# Altium project TPA3126.PrjPcb
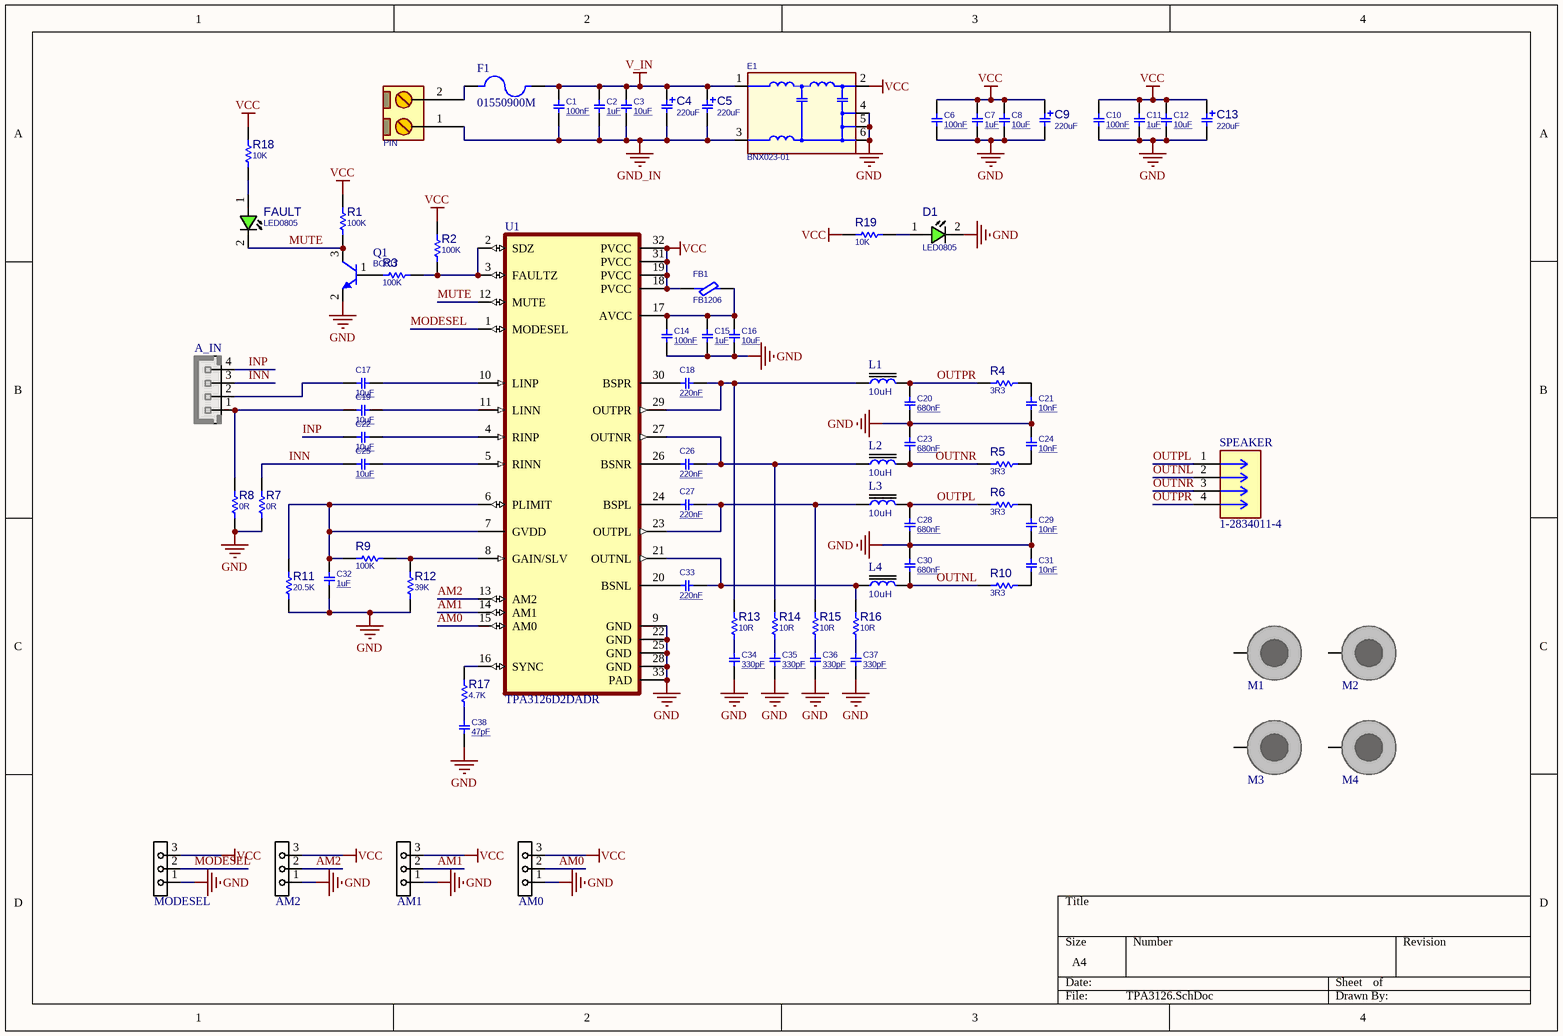
[diagram p0: TPA3126.SchDoc]
1 sheet, 79 parts. Net scope: global (net labels, ports and power ports of the same name join across sheets).
Board file: TPA3126.PcbDoc

## Sheet TPA3126.SchDoc
size A4; SheetNumber: 1; SheetTotal: 1

### Parts
A_IN  HHDR_4  [XH_4]  (value not drawn)
AM0  JMPHDR3PIN  [JP_3_60W]  (value not drawn)
AM1  JMPHDR3PIN  [JP_3_60W]  (value not drawn)
AM2  JMPHDR3PIN  [JP_3_60W]  (value not drawn)
C1  100nF  [C0805]
C2  1uF  [C0805]
C3  10uF  [C0805]
C4  220uF  [C_EL_8X12]
C5  220uF  [C_EL_8X12]
C6  100nF  [C0805]
C7  1uF  [C0805]
C8  10uF  [C0805]
C9  220uF  [C_EL_8X12]
C10  100nF  [C0805]
C11  1uF  [C0805]
C12  10uF  [C0805]
C13  220uF  [C_EL_8X12]
C14  100nF  [C0805]
C15  1uF  [C0805]
C16  10uF  [C0805]
C17  10uF  [C0805]
C18  220nF  [C0603]
C19  10uF  [C0805]
C20  680nF  [C0805]
C21  10nF  [C0805]
C22  10uF  [C0805]
C23  680nF  [C0805]
C24  10nF  [C0805]
C25  10uF  [C0805]
C26  220nF  [C0603]
C27  220nF  [C0603]
C28  680nF  [C0805]
C29  10nF  [C0805]
C30  680nF  [C0805]
C31  10nF  [C0805]
C32  1uF  [C0805]
C33  220nF  [C0603]
C34  330pF  [C0805]
C35  330pF  [C0805]
C36  330pF  [C0805]
C37  330pF  [C0805]
C38  47pF  [C0805]
D1  LED0805  [LED0805]
E1  BNX023-01  [BNX02]
F1  01550900M  [FUSE_01550900M]
FAULT  LED0805  [LED0805]
FB1  FB1206  [L1206]
L1  10uH  [L_12]
L2  10uH  [L_12]
L3  10uH  [L_12]
L4  10uH  [L_12]
M1  DNP/MH  [SCMH_M3P5FT]  (value not drawn)  (no BOM)
M2  DNP/MH  [SCMH_M3P5FT]  (value not drawn)  (no BOM)
M3  DNP/MH  [SCMH_M3P5FT]  (value not drawn)  (no BOM)
M4  DNP/MH  [SCMH_M3P5FT]  (value not drawn)  (no BOM)
MODESEL  JMPHDR3PIN  [JP_3_60W]  (value not drawn)
PIN  CONN_TB2  [MSTB_2]  (value not drawn)
Q1  BC817  [SOT23_3]
R1  100K  [R0805]
R2  100K  [R0805]
R3  100K  [R0805]
R4  3R3  [R0805]
R5  3R3  [R0805]
R6  3R3  [R0805]
R7  0R  [R0805]
R8  0R  [R0805]
R9  100K  [R0805]
R10  3R3  [R0805]
R11  20.5K  [R0805]
R12  39K  [R0805]
R13  10R  [R0805]
R14  10R  [R0805]
R15  10R  [R0805]
R16  10R  [R0805]
R17  4.7K  [R0805]
R18  10K  [R0805]
R19  10K  [R0805]
SPEAKER  1-2834011-4  [CONN_1-2834011-4]
U1  TPA3126D2DADR  [SOP65P810X115-33N]

### Nets
GND: AM0.1 AM1.1 AM2.1 C6.2 C7.2 C8.2 C9.2 C10.2 C11.2 C12.2 C13.2 C14.2 C15.2 C16.2 C20.2 C21.1 C23.1 C24.2 C28.2 C29.1 C30.1 C31.2 C32.2 C34.2 C35.2 C36.2 C37.2 C38.2 D1.2(CATHODE) E1.4(CG1) E1.5(CG2) E1.6(CG3) MODESEL.1 Q1.2(E) R7.2 R8.2 R11.2 R12.2 U1.9(GND) U1.22(GND) U1.25(GND) U1.28(GND) U1.33(PAD)
GND_IN: C1.2 C2.2 C3.2 C4.2 C5.2 E1.3(PSG) PIN.1
V_IN: C1.1 C2.1 C3.1 C4.1 C5.1 E1.1(B) F1.2
VCC: AM0.3 AM1.3 AM2.3 C6.1 C7.1 C8.1 C9.1 C10.1 C11.1 C12.1 C13.1 E1.2(CB) FB1.2 MODESEL.3 R1.2 R2.2 R18.1 R19.1 U1.18(PVCC) U1.19(PVCC) U1.31(PVCC) U1.32(PVCC)
AM0: AM0.2 U1.15(AM0)
AM1: AM1.2 U1.14(AM1)
AM2: AM2.2 U1.13(AM2)
INN: A_IN.3 C25.1 R7.1
INP: A_IN.4 C22.1
MODESEL: MODESEL.2 U1.1(MODESEL)
MUTE: FAULT.2(CATHODE) Q1.3(C) R1.1 U1.12(MUTE)
OUTNL: C30.2 L4.2 R10.2 SPEAKER.2
OUTNR: C23.2 L2.2 R5.2 SPEAKER.3
OUTPL: C28.1 L3.2 R6.2 SPEAKER.1
OUTPR: C20.1 L1.2 R4.2 SPEAKER.4
NetA_IN_1: A_IN.1 C19.1 R8.1
NetA_IN_2: A_IN.2 C17.1
NetC14_1: C14.1 C15.1 C16.1 FB1.1 U1.17(AVCC)
NetC17_2: C17.2 U1.10(LINP)
NetC18_1: C18.1 U1.30(BSPR)
NetC18_2: C18.2 L1.1 R13.2 U1.29(OUTPR)
NetC19_2: C19.2 U1.11(LINN)
NetC21_2: C21.2 R4.1
NetC22_2: C22.2 U1.4(RINP)
NetC24_1: C24.1 R5.1
NetC25_2: C25.2 U1.5(RINN)
NetC26_1: C26.1 U1.26(BSNR)
NetC26_2: C26.2 L2.1 R14.2 U1.27(OUTNR)
NetC27_1: C27.1 U1.24(BSPL)
NetC27_2: C27.2 L3.1 R15.2 U1.23(OUTPL)
NetC29_2: C29.2 R6.1
NetC31_1: C31.1 R10.1
NetC32_1: C32.1 R9.1 R11.1 U1.6(PLIMIT) U1.7(GVDD)
NetC33_1: C33.1 U1.20(BSNL)
NetC33_2: C33.2 L4.1 R16.2 U1.21(OUTNL)
NetC34_1: C34.1 R13.1
NetC35_1: C35.1 R14.1
NetC36_1: C36.1 R15.1
NetC37_1: C37.1 R16.1
NetC38_1: C38.1 R17.1
NetD1_1: D1.1(ANODE) R19.2
NetF1_1: F1.1 PIN.2
NetFAULT_1: FAULT.1(ANODE) R18.2
NetQ1_1: Q1.1(B) R3.2
NetR2_1: R2.1 R3.1 U1.2(SDZ) U1.3(FAULTZ)
NetR9_2: R9.2 R12.1 U1.8(GAIN/SLV)
NetR17_2: R17.2 U1.16(SYNC)

Not connected (* = marked no-connect by the designer): M1 1; M2 1; M3 1; M4 1

### Library data of the parts
A_IN = XH_4: JST-XH pitch: 2.5mm; VALUE: HHDR_4
AM0-AM2 MODESEL = JUMPER_SOLDER_3P: JUMPER, HEADER 3PIN; MANF: MANF; MANF_P#: MANF_P#; VALUE: JMPHDR3PIN
C1 C6 C10 C14 = CAP_SMD_MLCC: CAP, MLCC, 100nF, 50V, C0G, 10%, 0402; DESC: CAP, MLCC, 1nF, 50V, C0G, 10%, 0402; MANF_P#: MANF_PART#; MANF: Murata; PARAM: C0G, 10%; PRICE: 100= 1$; PARAM2: 50V; ASSEMBLY: ASSEMBLY; VALUE: 100nF
C2 C7 C11 C15 C32 = CAP_SMD_MLCC: CAP, MLCC, 1uF, 50V, C0G, 10%, 0402; DESC: CAP, MLCC, 1nF, 50V, C0G, 10%, 0402; MANF_P#: MANF_PART#; MANF: Murata; PARAM: C0G, 10%; PRICE: 100= 1$; PARAM2: 50V; ASSEMBLY: ASSEMBLY; VALUE: 1uF
C3 C8 C12 C16 C17 C19 C22 C25 = CAP_SMD_MLCC: CAP, MLCC, 10uF, 50V, C0G, 10%, 0402; DESC: CAP, MLCC, 1nF, 50V, C0G, 10%, 0402; MANF_P#: MANF_PART#; MANF: Murata; PARAM: C0G, 10%; PRICE: 100= 1$; PARAM2: 50V; ASSEMBLY: ASSEMBLY; VALUE: 10uF
C4 C5 C9 C13 = CAP_THD_EL: CAP, THD, ELEC,; MANF_P#: MANF_PART#; PARAM2: 35V; DESC: DESCRIPTION; DIST#: MOUSER; PARAM: 20%; PRICE: 10= 5$; MANF: MANF; ASSEMBLY: ASSEMBLY; VALUE: 220uF
C18 C26 C27 C33 = CAP_SMD_MLCC: CAP, MLCC, 220nF, 50V, C0G, 10%, 0402; DESC: CAP, MLCC, 1nF, 50V, C0G, 10%, 0402; MANF_P#: MANF_PART#; MANF: Murata; PARAM: C0G, 10%; PRICE: 100= 1$; PARAM2: 50V; ASSEMBLY: ASSEMBLY; VALUE: 220nF
C20 C23 C28 C30 = CAP_SMD_MLCC: CAP, MLCC, 650nF, 50V, C0G, 10%, 0402; DESC: CAP, MLCC, 1nF, 50V, C0G, 10%, 0402; MANF_P#: MANF_PART#; MANF: Murata; PARAM: C0G, 10%; PRICE: 100= 1$; PARAM2: 50V; ASSEMBLY: ASSEMBLY; VALUE: 680nF
C21 C24 C29 C31 = CAP_SMD_MLCC: CAP, MLCC, 10nF, 50V, C0G, 10%, 0402; DESC: CAP, MLCC, 1nF, 50V, C0G, 10%, 0402; MANF_P#: MANF_PART#; MANF: Murata; PARAM: C0G, 10%; PRICE: 100= 1$; PARAM2: 50V; ASSEMBLY: ASSEMBLY; VALUE: 10nF
C34-C37 = CAP_SMD_MLCC: CAP, MLCC, 330pF, 50V, C0G, 10%, 0402; DESC: CAP, MLCC, 1nF, 50V, C0G, 10%, 0402; MANF_P#: MANF_PART#; MANF: Murata; PARAM: C0G, 10%; PRICE: 100= 1$; PARAM2: 50V; ASSEMBLY: ASSEMBLY; VALUE: 330pF
C38 = CAP_SMD_MLCC: CAP, MLCC, 47pF, 50V, C0G, 10%, 0402; DESC: CAP, MLCC, 1nF, 50V, C0G, 10%, 0402; MANF_P#: MANF_PART#; MANF: Murata; PARAM: C0G, 10%; PRICE: 100= 1$; PARAM2: 50V; ASSEMBLY: ASSEMBLY; VALUE: 47pF
D1 FAULT = LED_SMD_0805: LED, SMD, 0805 red; DESC: DESCRIPTION; MANF_P#: MANF_PART#; PARAM2: 2.2V; MANF: MANF; ASSEMBLY: ASSEMBLY; PRICE: PRICE; VALUE: LED0805
E1 = BNX023-01: EMIFIL, BLOCK TYPE,; MANF: Murata; PARAM: 15A, 100V, -40~125oC, 1M~1GHz; DESC: DESCRIPTION; MANF_P#: BNX023-01; MANF: MURATA; ASSEMBLY: ASSEMBLY; PRICE: 6.5$; VALUE: BNX023-01
F1 = 01550900M: Fuse Block, Cartridge, OMNI-BLOK Series, 125V, 10A, J-Lead | Littelfuse 01550900M; MF: Littelfuse Inc.; SnapEDA_Link: https://www.snapeda.com/parts/01550900M/Littelfuse/view-part/?ref=snap; Package: None; Value: *; MP: 01550900M; Check_prices: https://www.snapeda.com/parts/01550900M/Littelfuse/view-part/?ref=eda
FB1 = FBEAD_SMD: FERRITE_Bead, SMD; MANF: MURATA; PARAM: 120@100MHz; PARAM2: 1A; MANF_P#: BLM15AG121SN1D; VALUE: FB1206
L1-L4 = INDPWR_SMD: INDUCTOR, POWER, SMD; VALUE: 10uH
M1-M4 = SCMH_M3P5FT: SCREW mouting, M3.5, 3.5mm diameter and 7.0mm, FlatHead; ASSEMBLY: DNP; VALUE: DNP/MH
PIN = CONN_MSTB_2: CONN, PHOENIX MSTB, 5-G, 5.08mm pitch; VALUE: CONN_TB2
Q1 = NPN_BC817_SOT23: BJT, NPN, 45v, 0.5A, SMD, SOT23; PARAM: 0.5A, Hfe100~600; PARAM2: 45v, 250mW; MANF: NXP, ON; MANF_P#: BC817; VALUE: BC817
R1-R19 = RES_SMD: RESISTOR, SMD; PARAM: -W; DESC: DESCRIPTION; DIST#: MOUSER; PARAM2: 1%; MANF_P#: -; MANF: -; ASSEMBLY: ASSEMBLY; PRICE: 100= 0.5$
  R1-R3 R9: VALUE: 100K
  R4-R6 R10: VALUE: 3R3
  R7 R8: VALUE: 0R
  R11: VALUE: 20.5K
  R12: VALUE: 39K
  R13-R16: VALUE: 10R
  R17: VALUE: 4.7K
  R18 R19: VALUE: 10K
U1 = TPA3126D2DADR: 50-W stereo, 100-W mono, 4.5- to 26-V, analog input Class-D audio amplifier w/ low idle current 32-HTSSOP -40 to 85
SPEAKER = 1-2834011-4: Price: None; Package: None; Value: *; MP: 1-2834011-4; Availability: Unavailable